# EAGLE design Adafruit FXOS8700 FXAS21002 9 DoF Breakout (EAGLE 6.6.0)
COMPANY: ADAFRUIT INDUSTRIES; DRAWN: KTOWN; REV: A
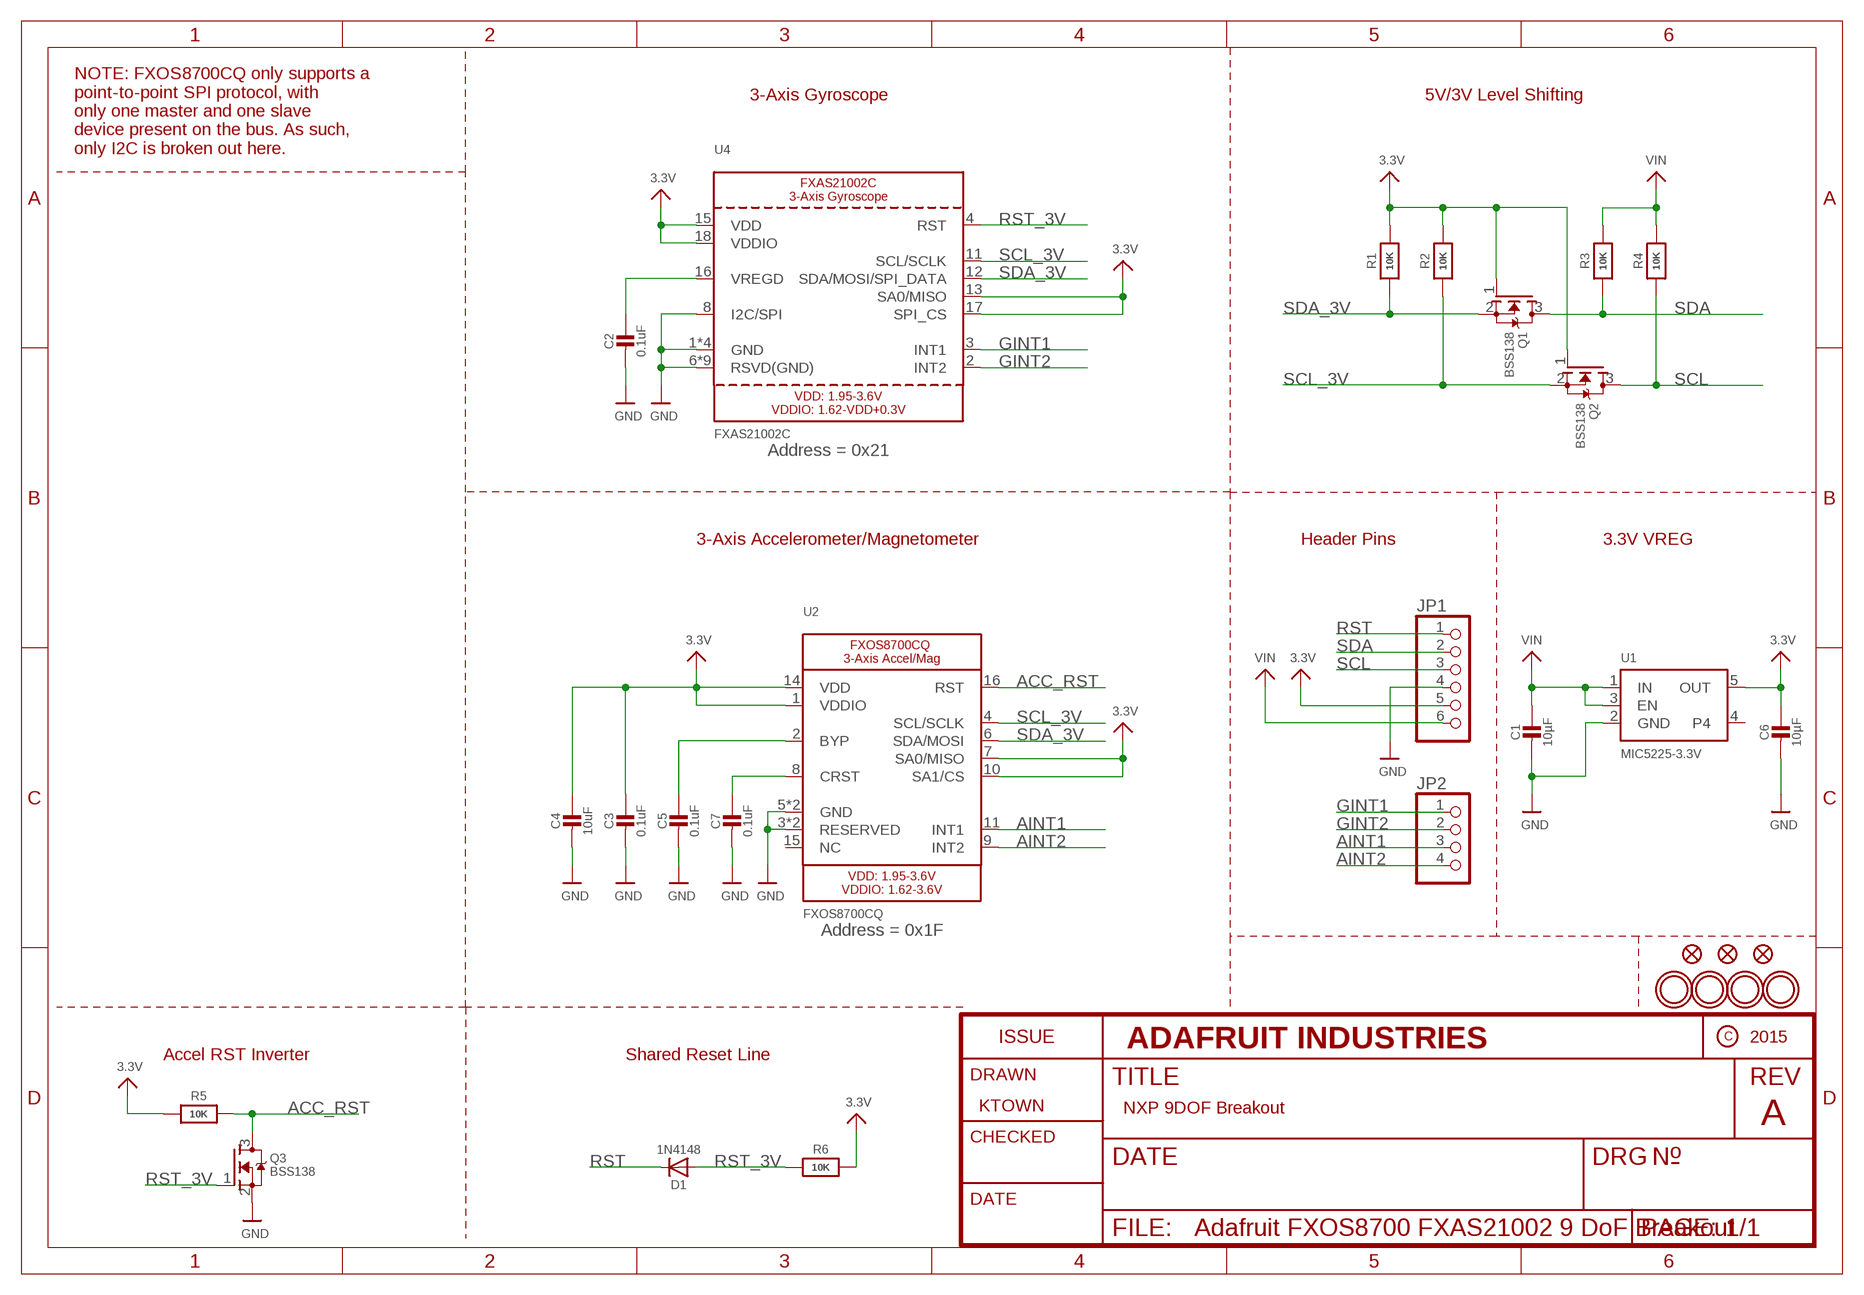
[diagram p0: schematic, sheet 1]

## Parts
C1  10µF  CAP_CERAMIC0805-NOOUTLINE  [0805-NO]
C2  0.1uF  CAP_CERAMIC0805-NOOUTLINE  [0805-NO]
C3  0.1uF  CAP_CERAMIC0805-NOOUTLINE  [0805-NO]
C4  10uF  CAP_CERAMIC0805-NOOUTLINE  [0805-NO]
C5  0.1uF  CAP_CERAMIC0805-NOOUTLINE  [0805-NO]
C6  10µF  CAP_CERAMIC0805-NOOUTLINE  [0805-NO]
C7  0.1uF  CAP_CERAMIC0805-NOOUTLINE  [0805-NO]
D1  1N4148  DIODESOD-323  [SOD-323]
FID1  FIDUCIAL_1MM  [FIDUCIAL_1MM]
FID2  FIDUCIAL_1MM  [FIDUCIAL_1MM]
FID3  FIDUCIAL_1MM  [FIDUCIAL_1MM]
JP1  HEADER-1X670MIL  [1X06_ROUND_70]
JP2  HEADER-1X4ROUND  [1X04_ROUND]
Q1  BSS138  MOSFET-NWIDE  [SOT23-WIDE]
Q2  BSS138  MOSFET-NWIDE  [SOT23-WIDE]
Q3  BSS138  MOSFET-NWIDE  [SOT23-WIDE]
R1  10K  RESISTOR0805_NOOUTLINE  [0805-NO]
R2  10K  RESISTOR0805_NOOUTLINE  [0805-NO]
R3  10K  RESISTOR0805_NOOUTLINE  [0805-NO]
R4  10K  RESISTOR0805_NOOUTLINE  [0805-NO]
R5  10K  RESISTOR0805_NOOUTLINE  [0805-NO]
R6  10K  RESISTOR0805_NOOUTLINE  [0805-NO]
U1  MIC5225-3.3V  VREG_SOT23-5  [SOT23-5]
U2  FXOS8700CQ  ACCEL_MAG_FXOS8700CQ  [QFN16_3MM_FREESCALE_5X3]
U4  FXAS21002C  GYRO_FXAS21002C  [QFN24_4MM_FREESCALE_7X5]
U$1  MOUNTINGHOLE2.5  [MOUNTINGHOLE_2.5_PLATED]
U$2  MOUNTINGHOLE2.5  [MOUNTINGHOLE_2.5_PLATED]
U$3  MOUNTINGHOLE2.5  [MOUNTINGHOLE_2.5_PLATED]
U$4  MOUNTINGHOLE2.5  [MOUNTINGHOLE_2.5_PLATED]

## Nets
3.3V: C3.1 C4.1 C6.1 JP1.5 Q1.1(G) Q2.1(G) R1.2 R2.2 R5.1 R6.2 U1.5(OUT) U2.1(VDDIO) U2.7(SA0/MISO) U2.10(SA1/CS) U2.14(VDD) U4.13(SA0/MISO) U4.15(VDD) U4.17(SPI_CS) U4.18(VDDIO)
ACC_RST: Q3.3(D) R5.2 U2.16(RST)
AINT1: JP2.3 U2.11(INT1)
AINT2: JP2.4 U2.9(INT2)
GINT1: JP2.1 U4.3(INT1)
GINT2: JP2.2 U4.2(INT2)
GND: C1.2 C2.2 C3.2 C4.2 C5.2 C6.2 C7.2 JP1.4 Q3.2(S) U1.2(GND) U2.3(RESERVED) U2.5(GND) U2.12(GND) U2.13(RESERVED) U4.1(GND) U4.5(GND) U4.6(RSVD(GND)) U4.7(RSVD(GND)) U4.8(I2C/SPI) U4.9(RSVD(GND)) U4.10(RSVD(GND)) U4.14(GND) U4.19(GND) U4.20(RSVD(GND)) U4.21(RSVD(GND)) U4.22(RSVD(GND)) U4.23(RSVD(GND)) U4.24(RSVD(GND))
N$1: C2.1 U4.16(VREGD)
N$24: C5.1 U2.2(BYP)
N$26: C7.1 U2.8(CRST)
RST: D1.C JP1.1
RST_3V: D1.A Q3.1(G) R6.1 U4.4(RST)
SCL: JP1.3 Q2.3(D) R4.1
SCL_3V: Q2.2(S) R2.1 U2.4(SCL/SCLK) U4.11(SCL/SCLK)
SDA: JP1.2 Q1.3(D) R3.1
SDA_3V: Q1.2(S) R1.1 U2.6(SDA/MOSI) U4.12(SDA/MOSI/SPI_DATA)
VIN: C1.1 JP1.6 R3.2 R4.2 U1.1(IN) U1.3(EN)
Unconnected: U1.4 U2.15(NC)

## Notes on the sheet
- 3-Axis Gyroscope | 5V/3V Level Shifting
- NOTE: FXOS8700CQ only supports a
  point-to-point SPI protocol, with
  only one master and one slave
  device present on the bus. As such,
  only I2C is broken out here.
- Address = 0x21
- 3-Axis Accelerometer/Magnetometer | Header Pins | 3.3V VREG
- Address = 0x1F
- Accel RST Inverter | Shared Reset Line
- NXP 9DOF Breakout

## Library data of the parts
C1-C7 = microbuilder:CAP_CERAMIC: Ceramic Capacitors For new designs, use the packages preceded by an '_' character since they are more reliable: The following footprints should be used on most boards: _0402 - Standard footprint for regular board layouts _0603 - Standard footprint for regular board layouts _0805 - Standard footprint for regular board layouts _1206 - Standard footprint for regular board layouts For extremely tight-pitch boards where space is at a premium, the following 'micro-pitch' footprints can be used (smaller pads, no silkscreen outline, etc.): _0402MP - Micro-pitch footprint for very dense/compact boards _0603MP - Micro-pitch footprint for very dense/compact boards _0805MP - Micro-pitch footprint for very dense/compact boards _1206MP - Micro-pitch footprint for very dense/compact boards
D1 = microbuilder:DIODE: Diode SMA Model Volts Amps Type Vf Ir Digikey # Notes SSA34-E3 40V 3A Schottky 480mV @ 3A 200uA @ 40V SSA34-E3/61TGITR-ND CDBA120-G 20V 1A Schottky 500mV @ 1A 500uA @ 20V 641-1014-6-ND REEL MBRA210 10V 2A Schottky 350mV @ 2A 700uA @ 10V MBRA210LT3 SOD-123 Model Volts Amps Type Vf Ir Order # Notes BAT54T1G 30V 200mA Schottky 800mV @ 200mA 2uA @ 25V BAT54T1GOSTR-ND B0530W 30V 500mA Schottky 430mV @ 500mA 130uA @ 30V B0530W-FDICT-ND REEL MBR120 20V 1A Schottky 340mV @ 1A MBR120VLSFT1GOSCT-ND SOD-323 Model Volts Amps Type Vf Ir Order # Notes PMEG2005EJ 20V 500mA Schottky 355mV @ 500mA 568-4110-1-ND ZLLS410 10V 570mA Schottky 380mV @ 570mA ZLLS410CT-ND 1N4148WS 75V 150mA Silicon/Simple 1V 1N4148WSFSCT-ND REEL SOD-523 Model Volts Amps Type Vf Ir Order # Notes BAT54XV2 30V 200mA Schottky 0.8V @ 100mA BAT54XV2CT-ND TB751S 30V 30mA Schottky RB751S-40TE61CT-ND SOT23-R/W (R = Solder Paste/Reflow Ovens, W = Hand-Soldering) Model Volts Amps Type Vf Ir Order # Notes BAT54FILM 40V 300mA Schottky 497-7162-1-ND POWERDI-5 Model Volts Amps Type Vf Ir Order # Notes PDS560 60V 5A Schottky 670mV @ 5A 150uA @ 60V PDS560DICT-ND
FID1-FID3 = microbuilder:FIDUCIAL: Fiducial Alignment Points Various fiducial points for machine vision alignment.; BOM: EXCLUDE
JP1 = microbuilder:HEADER-1X6: PIN HEADER
JP2 = microbuilder:HEADER-1X4: PIN HEADER
Q1-Q3 = microbuilder:MOSFET-N: N-Channel Mosfet LEGEND VDS: Voltage Drain-Source ID: Drain Current RDS(ON): Drain-Source On-State Resistance VGS(TH): Gate-Source Threshold Voltage CISS: Drain-Source Input Capacitance SOT-23 Name VDS ID RDS(ON) VGS(TH) CISS Order Number 2N7002E 60V 260mA 2.5 Ohm 2.5V @ 250uA 26.7pF @ 25V 2N7002ET1GOSTR-ND BSH103 30V 850mA 400 mOhm 400mV @ 1mA 83pF @ 24V BSH103,235-ND BSS138 60V 320mA 1.6 Ohm 1.5V @ 250uA 50pF @ 10V Mouser: 771-BSS138PW115 DMN2075U-7 20V 4.2A 38 mOhm 1V @ 250 uA 594.3pF @ 10V DMN2075U-7DICT-ND * BSS138 good choice for I2C level-shifting POWERPAK 1212-8 Name VDS ID RDS(ON) VGS(TH) CISS Order Number Si7308DN 60V 6A 58 mOhm 3V @ 250uA 665pF @ 15V SI7308DN-T1-E3CT-ND
R1-R6 = microbuilder:RESISTOR: Resistors For new designs, use the packages preceded by an '_' character since they are more reliable: The following footprints should be used on most boards: _0402 - Standard footprint for regular board layouts _0603 - Standard footprint for regular board layouts _0805 - Standard footprint for regular board layouts _1206 - Standard footprint for regular board layouts For extremely tight-pitch boards where space is at a premium, the following 'micro-pitch' footprints can be used (smaller pads, no silkscreen outline, etc.): _0402MP - Micro-pitch footprint for very dense/compact boards _0603MP - Micro-pitch footprint for very dense/compact boards _0805MP - Micro-pitch footprint for very dense/compact boards _1206MP - Micro-pitch footprint for very dense/compact boards
U1 = microbuilder:VREG_SOT23-5: SOT23-5 Fixed Voltage Regulators Part Current Out V Out V In V Dropout θJA (°C/W) TJ (°C) Digikey Part No. ADP121 150mA 3.3V 3.4-5.5V 0.09V @ 150mA -- -- ADP121-AUJZ33R7CT-ND ADP121 150mA 3.0V 3.1-5.5V 0.09V @ 150mA -- -- ADP121-AUJZ30R7CT-ND ADP122 300mA 3.3V 3.4-5.5V 0.085V @ 300mA -- -- ADP122AUJZ-3.3-R7CT-ND ADP1712 300mA 3.3V 3.5-5.5V 0.17V @ 300mA -- -- ADP1712AUJZ-3.3-R7TR-ND AP7311 (Low Cost) 150mA 3.3V 3.5-6V 0.15V @ 150mA -- -- AP7311-33WG-7DICT-ND LD39015M18R 150mA 1.8V 1.9V-5.5V 0.08V @ 100mA -- -- 497-6977-1-ND LP2985A-33DBVR 150mA 3.3V 3.3-16V 0.28V @ 150mA 206 150 296-18479-1-ND MCP1824T-3302E/OT 300mA 3.3V 3.5V-6V 0.2V @ 300mA -- -- MCP1824T-3302E/OTCT-ND MIC5205-2.5YM5 TR 150mA 2.5V 2.7-16V 0.165V @ 150mA -- -- 576-1257-2-ND MIC5205-3.0YM5 TR 150mA 3.0V 3.2V-16V 0.165V @ 150mA -- -- 576-1258-2-ND MIC5205-3.3YM5 TR 150mA 3.3V 3.5V-16V 0.165V @ 150mA -- -- 576-1259-2-ND TPS780330220 150mA 3.3V+2.2V 3.6-5.5V 250mV Max -- -- 296-23332-1-ND TDA3663/N1,135 100mA 3.3V 3.5-45V 0.18V @ 50mA -- -- 568-5343-1-ND Max operating temp can be calculated using θJA, TJ (max junction temperature), and power in watts. Set the "Maximum Ambient Temperature" until it reaches TJ ("Max Junction Temperature"), which is the absolute limit for safe use of the regulator: Heat Sink Temperature Calculator <http://www.daycounter.com/Calculators/Heat-Sink-Temperature-Calculator.phtml> For example, With 12V source into a 3.3V LP2985 and a 30mA load, we are dissipating (12V-3.3V) * 0.03A = 0.261W. With a θJA of 206 °C/W, a TJ of 150°C, and 261mW we can safely use the chip without a heat sink up to 75°C (=147.1°C Junction Temperature).
U2 = microbuilder:ACCEL_MAG_FXOS8700CQ: FX0S8700CQ - 3-Axis Accelerometer and Magnetometer Accel Range: +/-2/4/8 g Accel Data Rate: 1.6-800Hz (400Hz in hybrid mode) Accel Resolution: 14-bits Mag Range: 1200uT Mag Data Rate: 1.6-800Hz (400Hz in hybrid mode) Mag Resolution: 16-bits
U4 = microbuilder:GYRO_FXAS21002C: FXAS21002C - 3 Axis Gyroscope - 250/500/1000/2000dps Range: 250/500/1000/2000 dps Data Rate: 2.5-800Hz Resolution: 16-bits
U$1-U$4 = microbuilder:MOUNTINGHOLE: Mounting Hole For #2 screws (0.086"/2.18mm width, 0.094"/2.4mm hole) use 2.5mm; BOM: EXCLUDE

## Board
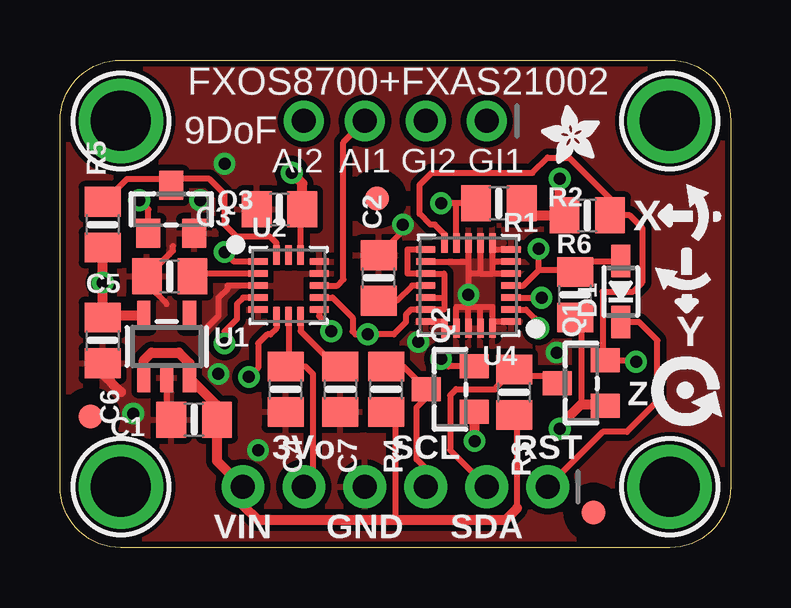
[diagram p1: board, top side]
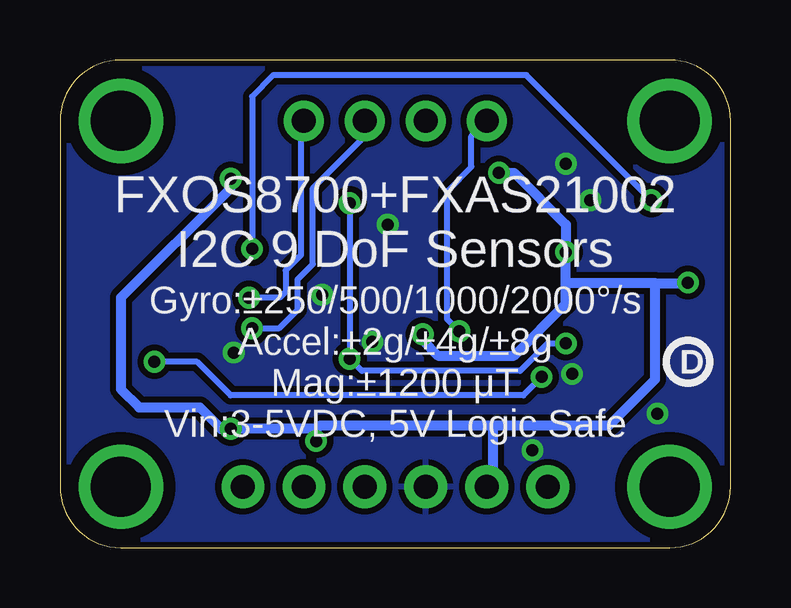
[diagram p2: board, bottom side, seen from below]

Size 27.94 x 20.32 mm. Coordinates in mm from the lower left corner, seen from the top.
Outline: 0,2.54 0,17.78 arc-90 2.54,20.32 25.4,20.32 arc-90 27.94,17.78 27.94,2.54 arc-90 25.4,0 2.54,0 arc-90 0,2.54
Copper layers (1*16): Top 0.035mm / dielectric 1.5mm / Bottom 0.035mm
Design rules "adafruit *": minimum track width 8mil, minimum drill 15.5mil, track to track 8mil, track to pad 8mil, pad to pad 8mil, via to via 8mil, smd to smd 8mil, copper to edge 10mil, drill to drill 8mil, minimum pad ring 10mil, minimum via ring 8mil, stop-mask expansion 2mil, vias tented up to drill 20mil, thermal gap 10mil
tRestrict: area 17.2,12.5 to 17.3,12.9; area 17.7,12.5 to 17.8,12.9; area 17.7,8.9 to 17.8,9.4; area 16.7,8.9 to 16.8,9.5; area 18.5,11.6 to 19,11.7; area 18.5,12.2 to 19,12.3
bRestrict: area 8,9.5 to 10.9,12.6

### Footprints (pad centres in the part's own frame; a part is rotated, then mirrored left to right if it is on the bottom)
0805-NO = smd 1.24 x 1.5: 1 -0.95,0; 2 0.95,0
SOD-323 = smd 1.35 x 0.8: A 1.27,0; C -1.27,0
FIDUCIAL_1MM = smd 1 x 1: 1 0,0
1X06_ROUND_70 = drill 1 pad 1.778: 1 -6.35,0; 2 -3.81,0; 3 -1.27,0; 4 1.27,0; 5 3.81,0; 6 6.35,0
1X04_ROUND = drill 1 pad 1.676: 1 -3.81,0; 2 -1.27,0; 3 1.27,0; 4 3.81,0
SOT23-WIDE = smd 1 x 1.2: 1 -0.95,-1; 2 0.95,-1; 3 0,1
SOT23-5 = smd 0.55 x 1.2: 1 -0.95,-1.3; 2 0,-1.3; 3 0.95,-1.3; 4 0.95,1.3; 5 -0.95,1.3
QFN16_3MM_FREESCALE_5X3 = smd 0.8 x 0.275: 1 -1.275,1; 2 -1.275,0.5; 3 -1.275,0; 4 -1.275,-0.5; 5 -1.275,-1; 9 1.275,-1; 10 1.275,-0.5; 11 1.275,0; 12 1.275,0.5; 13 1.275,1 | smd 0.275 x 0.8: 6 -0.5,-1.275; 7 0,-1.275; 8 0.5,-1.275; 14 0.5,1.275; 15 0,1.275; 16 -0.5,1.275
QFN24_4MM_FREESCALE_7X5 = smd 0.8 x 0.275: 1 -1.775,1.5; 2 -1.775,1; 3 -1.775,0.5; 4 -1.775,0; 5 -1.775,-0.5; 6 -1.775,-1; 7 -1.775,-1.5; 13 1.775,-1.5; 14 1.775,-1; 15 1.775,-0.5; 16 1.775,0; 17 1.775,0.5; 18 1.775,1; 19 1.775,1.5 | smd 0.275 x 0.8: 8 -1,-1.775; 9 -0.5,-1.775; 10 0,-1.775; 11 0.5,-1.775; 12 1,-1.775; 20 1,1.775; 21 0.5,1.775; 22 0,1.775; 23 -0.5,1.775; 24 -1,1.775
MOUNTINGHOLE_2.5_PLATED = drill 2.5 pad 3.2: P$1 0,0

### Placement (x,y rotation side)
C1  5.59,5.33 180 top
C2  13.27,11.24 90 top
C3  9.14,14.1 180 top
C4  9.4,6.6 270 top
C5  4.57,11.3 180 top
C6  1.78,8.64 270 top
C7  11.68,6.6 270 top
D1  23.37,10.67 90 top
FID1  22.23,1.46 0 top
FID2  1.27,5.46 0 top
FID3  13.21,14.54 0 top
JP1  13.97,2.54 180 top
JP2  13.97,17.78 180 top
Q1  21.72,6.86 90 top
Q2  16.26,6.6 90 top
Q3  4.64,14.1 0 top
R1  21.97,13.84 180 top
R2  18.29,14.35 0 top
R3  18.92,6.48 270 top
R4  13.59,6.6 270 top
R5  1.78,13.46 90 top
R6  21.46,10.54 270 top
U1  4.45,8.38 0 top
U2  9.53,10.92 0 top
U4  17.02,10.92 180 top
U$1  25.4,2.54 0 top
U$2  2.54,17.78 0 top
U$3  25.4,17.78 0 top
U$4  2.54,2.54 0 top
U$26  [ADAFRUIT_2.5MM]  22.48,16 90 top
U$27  [SYMBOL_GYRO_CCLOCKWISE]  24.89,12.57 0 top
U$28  [SYMBOL_GYRO_CLOCKWISE]  24.51,12.83 270 top
U$31  [SYMBOL_GYRO_Z]  24.64,5.08 0 top
U$32  [PCBFEAT-REV-040]  1.78,7.75 0 bottom

### Tracks (layer width: path | path; a pad name or v marks a point on that pad's centre or on a via)
3.3V  (via drill 0.5)
  Top 0.254: U4.17 15.99,10.42 16,10.41 | 16,10.41 16,9.92 U4.18 14.62,9.92 14.41,9.72 14.41,9.4 13.91,8.89 v12.83,8.89 12.32,8.89 12.19,9.02 12.19,9.59 11.36,10.42 U2.10 | 16,10.41 16,11.42 U4.15 14.48,11.43 14.48,12.42 U4.13 | U1.5 | U2.1 7.25,11.92 v6.86,12.32 | U2.14 10.03,14.1 C3.1 | 22.66,5.97 Q1.1 | U2.7 9.53,7.65 9.5,7.65 C4.1 10.23,7.55 10.54,7.24 10.54,2.92 JP1.5 | C6.1 1.87,9.68 | 20.7,4.95 v20.83,4.95 | 20.89,15.3 v20.83,15.37 | 17.26,4.46 v17.27,4.45 | R6.2 21.72,9.34 21.72,5.97 | R2.2 19.75,13.84 | R1.2 20.83,14.04
  Top 0.406: C6.1 v1.78,11.05 R5.1 | 22.66,5.97 21.72,5.97 20.7,4.95 | 1.87,9.68 U1.5 | C3.1 10.09,15.18 v9.65,15.62 | Q2.1 17.26,4.46 | 19.75,13.84 R1.2 | 20.83,14.04 v20.83,15.37
  Bottom 0.254: 17.14,5.08 17.27,4.95 | 21.23,4.95 v20.83,4.95 | 6.86,12.22 v6.86,12.32 | 1.81,11.02 v1.78,11.05
  Bottom 0.406: v12.83,8.89 12.83,8.64 12.19,8 9.02,8 6.86,10.16 6.86,11.05 | 6.86,11.05 v6.86,12.32 6.86,13.46 9.02,15.62 v9.65,15.62 | 9.91,5.08 5.08,5.08 3.15,7.01 3.15,11.02 | 9.91,5.08 17.14,5.08 | v20.83,4.95 17.27,4.95 v17.27,4.45 | 21.23,4.95 22.11,5.84 24.64,5.84 25.4,6.6 25.4,10.41 20.83,14.99 v20.83,15.37 | 3.15,11.02 6.83,11.02 6.86,11.05 | 3.15,11.02 1.81,11.02 | 9.91,5.08 9.91,2.79 JP1.5
ACC_RST
  Top 0.254: U2.16 9.03,12.69 8.76,12.95 7.37,12.95 6.86,13.46 6.86,14.73 6.22,15.37 4.64,15.37 | R5.2 1.78,14.35 2.79,15.37 4.64,15.37 | Q3.3 4.64,15.37
AINT1
  Top 0.254: U2.11 11.56,10.92 11.81,11.18 11.81,16.89 JP2.3
AINT2  (via drill 0.5)
  Top 0.254: U2.9 10.8,9.65 11.43,9.02 v11.3,9.02
  Bottom 0.254: v11.3,9.02 11.81,9.53 11.81,14.86 10.79,15.88 10.79,17.14 JP2.4
GINT1  (via drill 0.5)
  Top 0.254: U4.3 v20.07,10.41
  Bottom 0.254: v20.07,10.41 20.06,10.42 U4.3 18.54,10.67 18.54,11.56 17.91,12.19 17.91,17.65 JP2.1
GINT2  (via drill 0.5)
  Top 0.254: U4.2 19.41,9.92 20.07,9.27 v19.94,9.14
  Bottom 0.254: v19.94,9.14 18.8,9.14 18.03,9.91 18.03,11.18 17.4,11.81 17.4,14.99 15.24,17.14 JP2.2
GND  (via drill 0.5)
  Top 0.254: 17.02,10.03 16.52,10.03 U4.21 U4.20 16.02,9.42 U4.19 | 17.02,10.03 17.52,10.03 | 17.52,10.03 18.02,10.03 U4.24 18.02,9.42 U4.1 | U4.23 17.52,10.03 | U4.22 17.02,10.03 | U4.5 18.02,11.42 | 17.52,11.42 17.02,11.42 | 17.02,11.42 17.02,10.03 | U4.10 17.02,11.92 | 17.02,11.92 17.02,11.42 | U4.9 17.52,11.42 | 17.52,11.42 18.02,11.42 | U4.8 18.02,12.42 | 18.02,11.92 18.02,11.42 | U4.7 18.02,12.42 | 18.02,12.42 18.02,11.92 | U4.6 18.02,11.92 | U4.14 17.02,11.92 | U2.3 6.99,10.92 6.99,10.79 6.6,10.41 6.6,9.65 6.1,9.14 | 4.45,10.16 3.62,10.98 C5.2 4.7,12.38 4.7,12.57 | U1.2 4.45,5.33 C1.2 | C2.2 14.29,13.21 v14.29,13.46
  Top 0.406: C6.2 1.78,7.24 2.54,6.48
  other vias: 17.02,10.54 5.84,14.48 14.92,8.57 8.26,4.06 3.05,5.59 6.6,7.24 6.86,16 20.7,8.13
  pour Bottom (isolate 0.254): 0,2.54 0,17.78 arc-90 2.54,20.32 25.4,20.32 arc-90 27.94,17.78 27.94,2.54 arc-90 25.4,0 2.54,0 arc-90
  pour Top (isolate 0.254): 0,2.54 0,17.78 arc-90 2.54,20.32 25.4,20.32 arc-90 27.94,17.78 27.94,2.54 arc-90 25.4,0 2.54,0 arc-90
N$1
  Top 0.254: U4.16 14.67,10.92 14.04,10.29 C2.1
N$24
  Top 0.254: U2.2 5.64,11.42 C5.1
N$26
  Top 0.254: U2.8 10.03,9.03 11.5,7.55 C7.1
RST
  Top 0.254: D1.C 24.13,9.4 24.89,8.64 24.89,6.1 23.62,4.83 22.61,4.83 JP1.1
RST_3V  (via drill 0.5)
  Top 0.254: U4.4 19.3,10.92 19.94,11.56 | Q3.1 3.69,14.1 v3.3,14.48 | 19.94,11.56 v19.94,12.45 | R6.1 21.53,11.56 | 21.53,11.56 19.94,11.56 | 21.53,11.56 21.91,11.94 D1.A
  Bottom 0.254: v3.3,14.48 8.51,19.68 19.05,19.68 19.94,18.8 v19.94,12.45
SCL
  Top 0.254: JP1.3 15.24,3.3 14.86,3.68 14.86,5.84 15.26,6.24 Q2.3 14.31,7.55 R4.1
SCL_3V  (via drill 0.5)
  Top 0.254: U2.4 7.63,10.42 7.37,10.16 7.37,9.53 6.86,9.02 v6.86,8.51 | U4.11 16.52,14.34 16.51,14.35 | R2.1 16.51,14.35 | 16.51,14.35 v15.88,14.35 | Q2.2 16.2,7.55 v15.88,7.87
  Bottom 0.254: v15.88,14.35 v15.88,7.87 15.37,7.37 8.76,7.37 7.62,8.51 v6.86,8.51
SDA
  Top 0.254: Q1.3 20.43,7.15 19.2,7.15 R3.1 18.16,6.67 18.16,6.6 16.51,6.6 16.26,6.35 16.26,4.06 JP1.2 17.91,2.54
SDA_3V  (via drill 0.5)
  Top 0.254: U4.12 16.02,13.06 15.62,13.46 15.43,13.46 14.99,13.91 14.99,15.11 15.49,15.62 19.68,15.62 20.32,16.26 21.21,16.26 22.99,14.48 22.99,14.38 22.92,14.32 R1.1 23.75,13.84 24.26,13.34 24.26,11.05 23.88,10.67 22.61,10.67 22.61,7.7 Q1.2 23.94,7.81 v24,7.75 | U2.6 9.03,9.15 8.76,8.89 8.64,8.89 8.26,8.51 8.26,7.49 v7.87,7.11
  Bottom 0.254: v7.87,7.11 8.64,6.35 20.83,6.35 22.23,7.75 v24,7.75
VIN
  Top 0.254: 13.97,1.14 13.97,5.27 R4.2 | 6.54,5.94 C1.1 | 19.05,1.65 19.05,5.4 R3.2
  Top 0.406: 19.05,1.65 18.54,1.14 13.97,1.14 8.26,1.14 7.62,1.78 JP1.6 6.54,3.62 C1.1 | U1.1 3.5,7.81 3.81,8.13 4.95,8.13 5.39,7.69 U1.3 6.54,5.94

### Text on the board
tPlace: FXOS8700+FXAS21002 | 9DoF | AI2 | AI1 | GI2 | GI1 | X | Y | Z | 3Vo | SCL | RST | VIN | GND | SDA
bPlace: FXOS8700+FXAS21002 / I2C 9 DoF Sensors | Gyro:±250/500/1000/2000°/s / Accel:±2g/±4g/±8g / Mag:±1200 μT / Vin:3-5VDC, 5V Logic Safe